# EAGLE schematic Arduino-Pro-v12 (EAGLE 5.08)
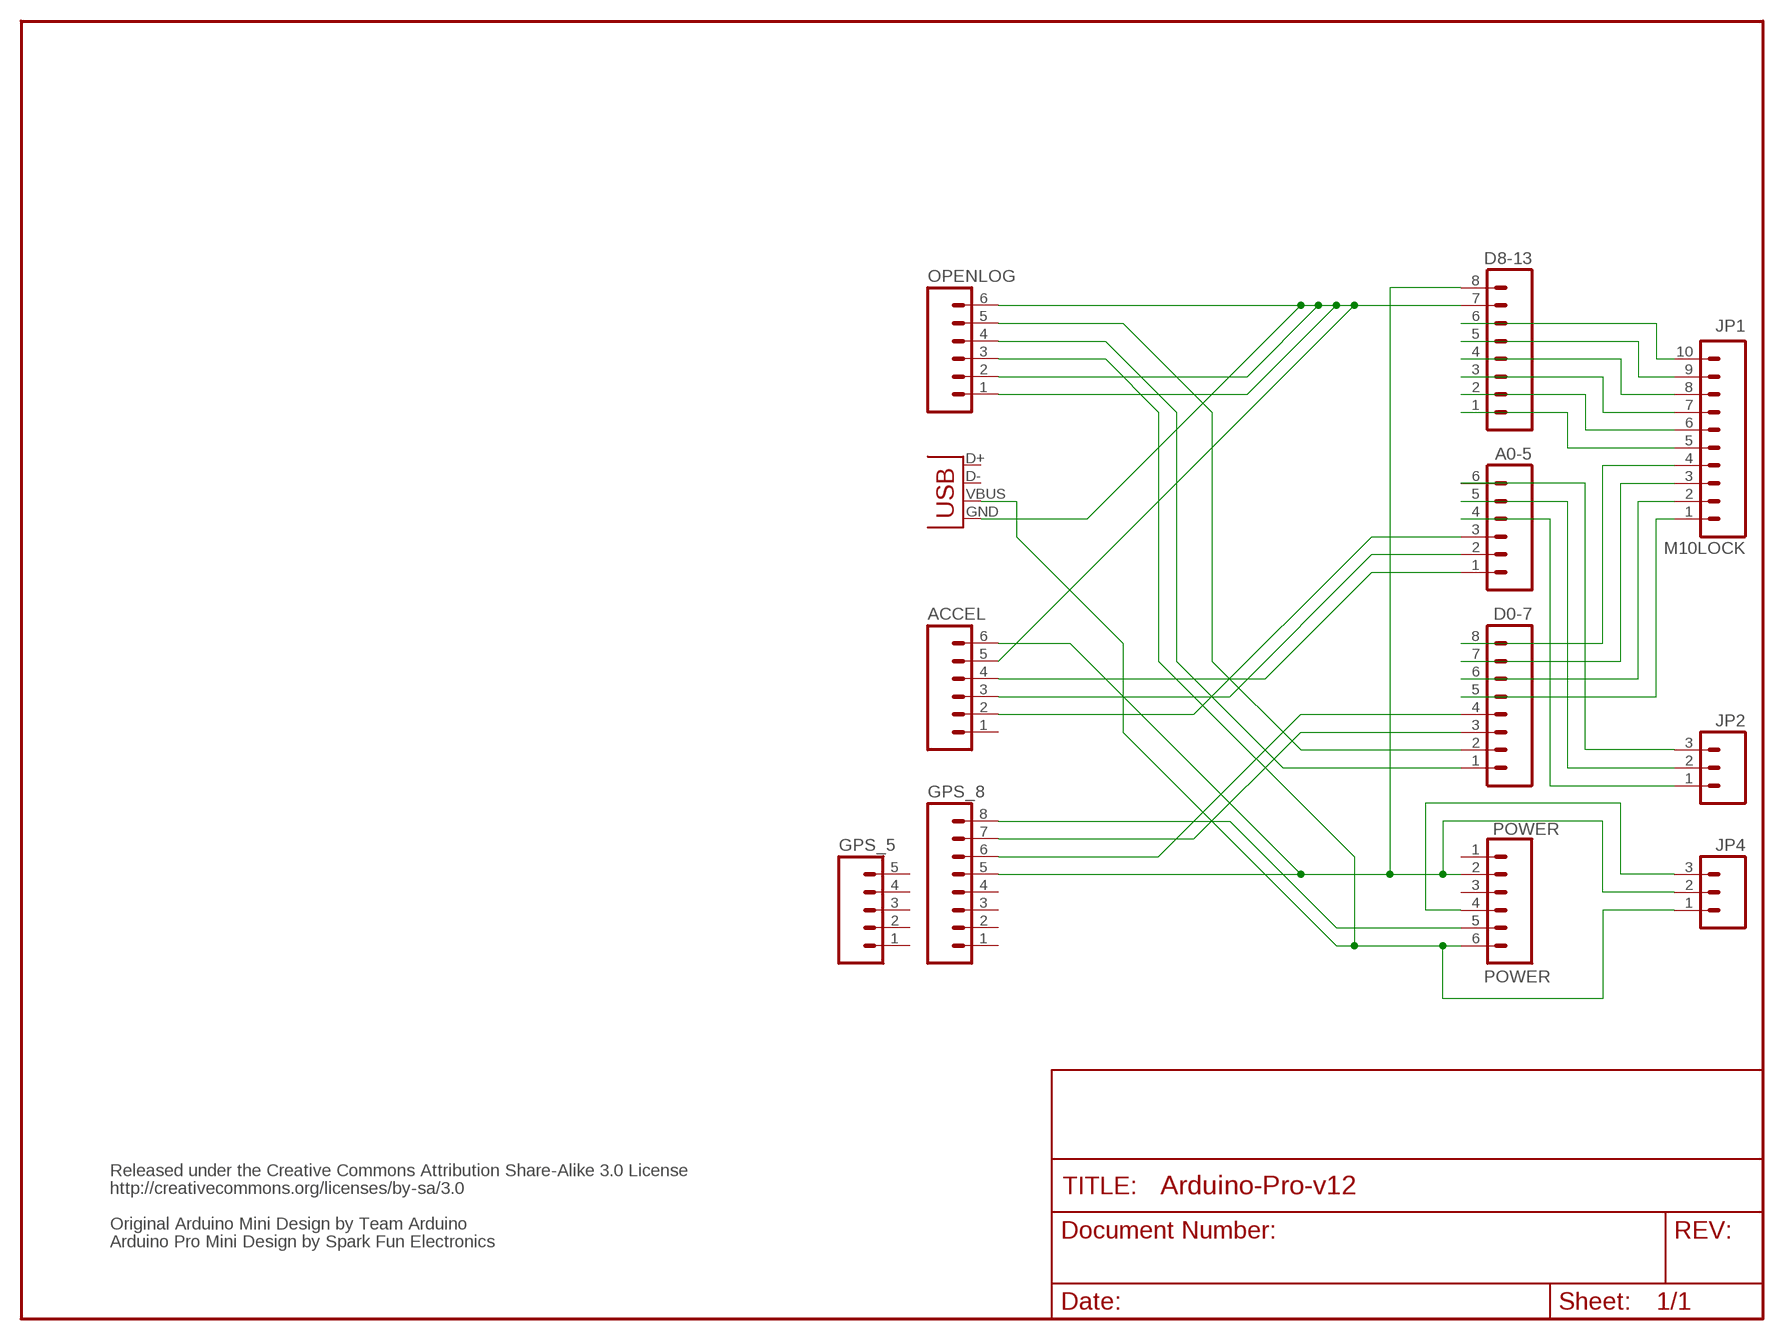
[diagram p0: schematic, sheet 1]

## Parts
A0-5  M06SIP  [1X06]
ACCEL  M06LOCK  [1X06_LOCK]
D0-7  M08  [1X08]
D8-13  M08  [1X08]
GPS_5  M05LOCK  [1X05_LOCK]
GPS_8  M08LOCK  [1X08_LOCK]
JP1  M10LOCK  [1X10_LOCK]
JP2  M03LOCK  [1X03_LOCK]
JP4  M03LOCK  [1X03_LOCK]
OPENLOG  M06LOCK  [1X06_LOCK]
POWER  POWER  M06SIP  [1X06]
X1  USB-MICROB  [USB-MICROB]

## Nets
N$1: GPS_8.8 POWER.5
N$2: ACCEL.5 D8-13.7 OPENLOG.1 OPENLOG.2 OPENLOG.6 X1.GND
N$3: D0-7.3 GPS_8.7
N$4: D0-7.4 GPS_8.6
N$5: JP4.3 POWER.4
N$7: A0-5.1 ACCEL.4
N$8: A0-5.2 ACCEL.3
N$9: A0-5.3 ACCEL.2
N$10: D0-7.1 OPENLOG.4
N$11: D0-7.2 OPENLOG.5
N$12: JP4.1 OPENLOG.3 POWER.6 X1.VBUS
N$13: D8-13.6 JP1.10
N$14: D8-13.5 JP1.9
N$15: D8-13.4 JP1.8
N$16: D8-13.3 JP1.7
N$17: D8-13.2 JP1.6
N$18: D8-13.1 JP1.5
N$19: D0-7.5 JP1.1
N$20: D0-7.6 JP1.2
N$21: D0-7.7 JP1.3
N$22: D0-7.8 JP1.4
N$23: A0-5.6 JP2.3
N$24: A0-5.5 JP2.2
N$25: A0-5.4 JP2.1
N$26: ACCEL.6 D8-13.8 GPS_8.5 JP4.2 POWER.2
Unconnected: ACCEL.1 GPS_5.1 GPS_5.2 GPS_5.3 GPS_5.4 GPS_5.5 GPS_8.1 GPS_8.2 GPS_8.3 GPS_8.4 POWER.1 POWER.3 X1.D+ X1.D-

## Notes on the sheet
- Released under the Creative Commons Attribution Share-Alike 3.0 License
- http://creativecommons.org/licenses/by-sa/3.0
- Original Arduino Mini Design by Team Arduino
- Arduino Pro Mini Design by Spark Fun Electronics

## Library data of the parts
A0-5 ACCEL OPENLOG POWER = SparkFun:M06: Header 6 Standard 6-pin 0.1" header. Use with straight break away headers (SKU : PRT-00116), right angle break away headers (PRT-00553), swiss pins (PRT-00743), machine pins (PRT-00117), and female headers (PRT-00115). Molex polarized connector foot print use with SKU : PRT-08094 with associated crimp pins and housings. NOTES ON THE VARIANTS LOCK and LOCK_LONGPADS... This footprint was designed to help hold the alignment of a through-hole component (i.e. 6-pin header) while soldering it into place. You may notice that each hole has been shifted either up or down by 0.005 of an inch from it's more standard position (which is a perfectly straight line). This slight alteration caused the pins (the squares in the middle) to touch the edges of the holes. Because they are alternating, it causes a "brace" to hold the component in place. 0.005 has proven to be the perfect amount of "off-center" position when using our standard breakaway headers. Although looks a little odd when you look at the bare footprint, once you have a header in there, the alteration is very hard to notice. Also, if you push a header all the way into place, it is covered up entirely on the bottom side. This idea of altering the position of holes to aid alignment will be further integrated into the Sparkfun Library for other footprints. It can help hold any component with 3 or more connection pins.
D0-7 D8-13 GPS_8 = SparkFun:M08: Header 8 Standard 8-pin 0.1" header. Use with straight break away headers (SKU : PRT-00116), right angle break away headers (PRT-00553), swiss pins (PRT-00743), machine pins (PRT-00117), and female headers (PRT-00115).
GPS_5 = SparkFun:M05: Header 5 Standard 5-pin 0.1" header. Use with straight break away headers (SKU : PRT-00116), right angle break away headers (PRT-00553), swiss pins (PRT-00743), machine pins (PRT-00117), and female headers (PRT-00115). Molex polarized connector foot print use with SKU : PRT-08230 with associated crimp pins and housings.
JP1 = SparkFun:M10: Header 10 Standard 10-pin 0.1" header. Use with straight break away headers (SKU : PRT-00116), right angle break away headers (PRT-00553), swiss pins (PRT-00743), machine pins (PRT-00117), and female headers (PRT-00115).
JP2 JP4 = SparkFun:M03: Header 3 Standard 3-pin 0.1" header. Use with straight break away headers (SKU : PRT-00116), right angle break away headers (PRT-00553), swiss pins (PRT-00743), machine pins (PRT-00117), and female headers (PRT-00115). Molex polarized connector foot print use with SKU : PRT-08232 with associated crimp pins and housings.
X1 = SparkFun:USB: USB Connectors USB-B-PTH is fully proven SKU : PRT-00139 USB-miniB is fully proven SKU : PRT-00587 USB-A-PCB is untested. USB-A-H is throughly reviewed, but untested. Spark Fun Electronics SKU : PRT-00437 USB-B-SMT is throughly reviewed, but untested. Needs silkscreen touching up. USB-A-S has not been used/tested USB-MB-H has not been used/tested

## Net classes
0 default: width 0.203 mm
1 vcc: width 0.254 mm